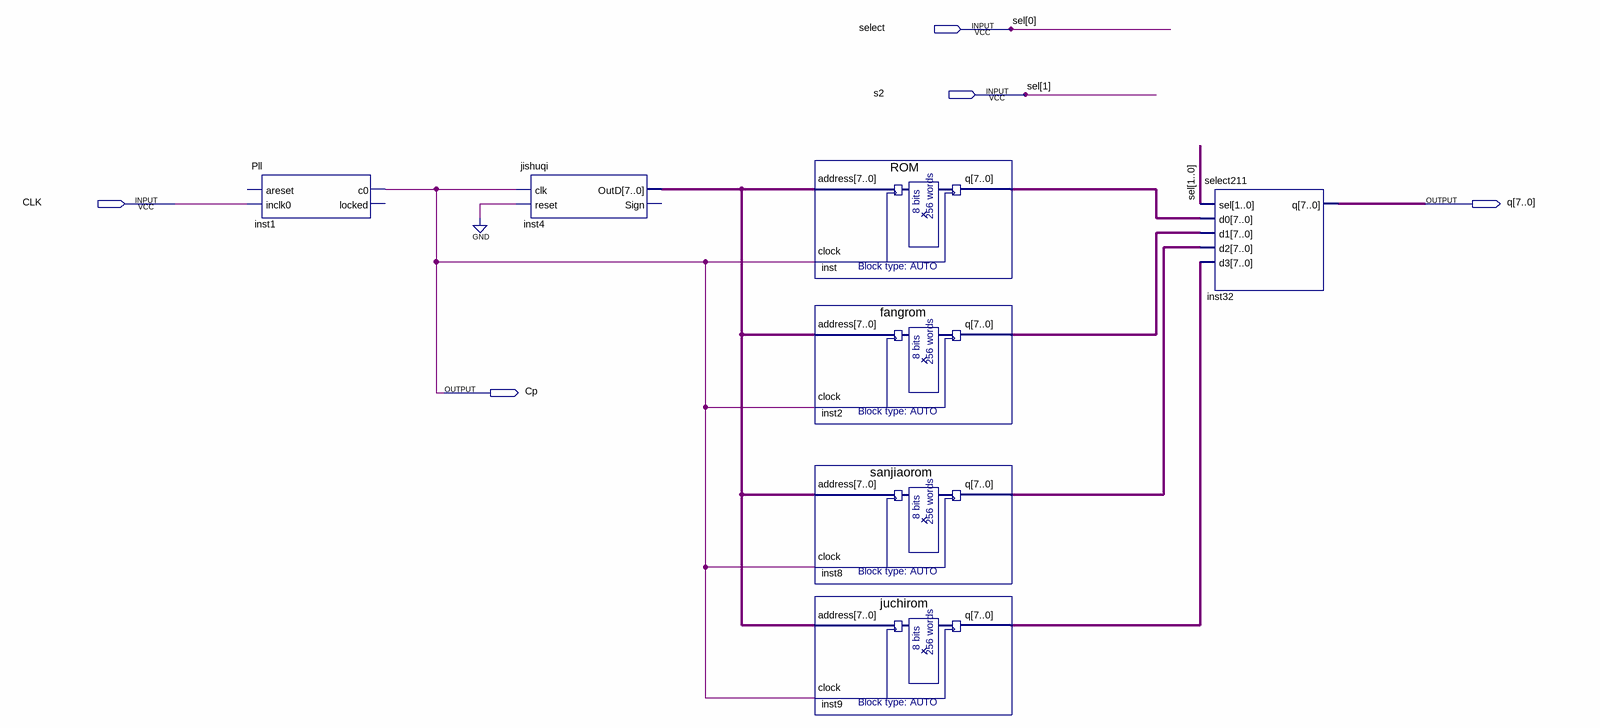
[diagram p0: schematic sheet]
// Quartus schematic test6.bdf as structural Verilog: 7 symbols, 5 pins
module test6 (
  input  select,
  input  s2,
  input  CLK,
  output [7:0] q,
  output Cp
);

  wire [7:0] inst2_q, inst4_outd, inst8_q, inst9_q, inst_q;

  Pll inst1 (.inclk0(CLK), .c0(Cp));  // open: areset, locked
  jishuqi inst4 (.clk(Cp), .reset(1'b0), .OutD(inst4_outd));  // open: Sign
  ROM inst (.address(inst4_outd), .clock(Cp), .q(inst_q));
  fangrom inst2 (.address(inst4_outd), .clock(Cp), .q(inst2_q));
  sanjiaorom inst8 (.address(inst4_outd), .clock(Cp), .q(inst8_q));
  juchirom inst9 (.address(inst4_outd), .clock(Cp), .q(inst9_q));
  select211 inst32 (.sel({s2, select}), .d0(inst_q), .d1(inst2_q), .d2(inst8_q), .d3(inst9_q), .q(q));

  // Other names for the same wires on the sheet: sel[1:0] = {s2, select}
endmodule
